# Altium schematic sheet Sheet1.SchDoc
size 420 x 297 mm; CheckedBy: Семенцов С. Г.; Author: Бакулевский М.; DocumentNumber: ИУ4.11.03.03.23.05.52.04.001 Э3; SheetNumber: 1; SheetTotal: 1; DocumentType: Схема электрическая принципиальная; FirstReferrence: ИУ4.11.03.03.23.05.52.04.001 СП
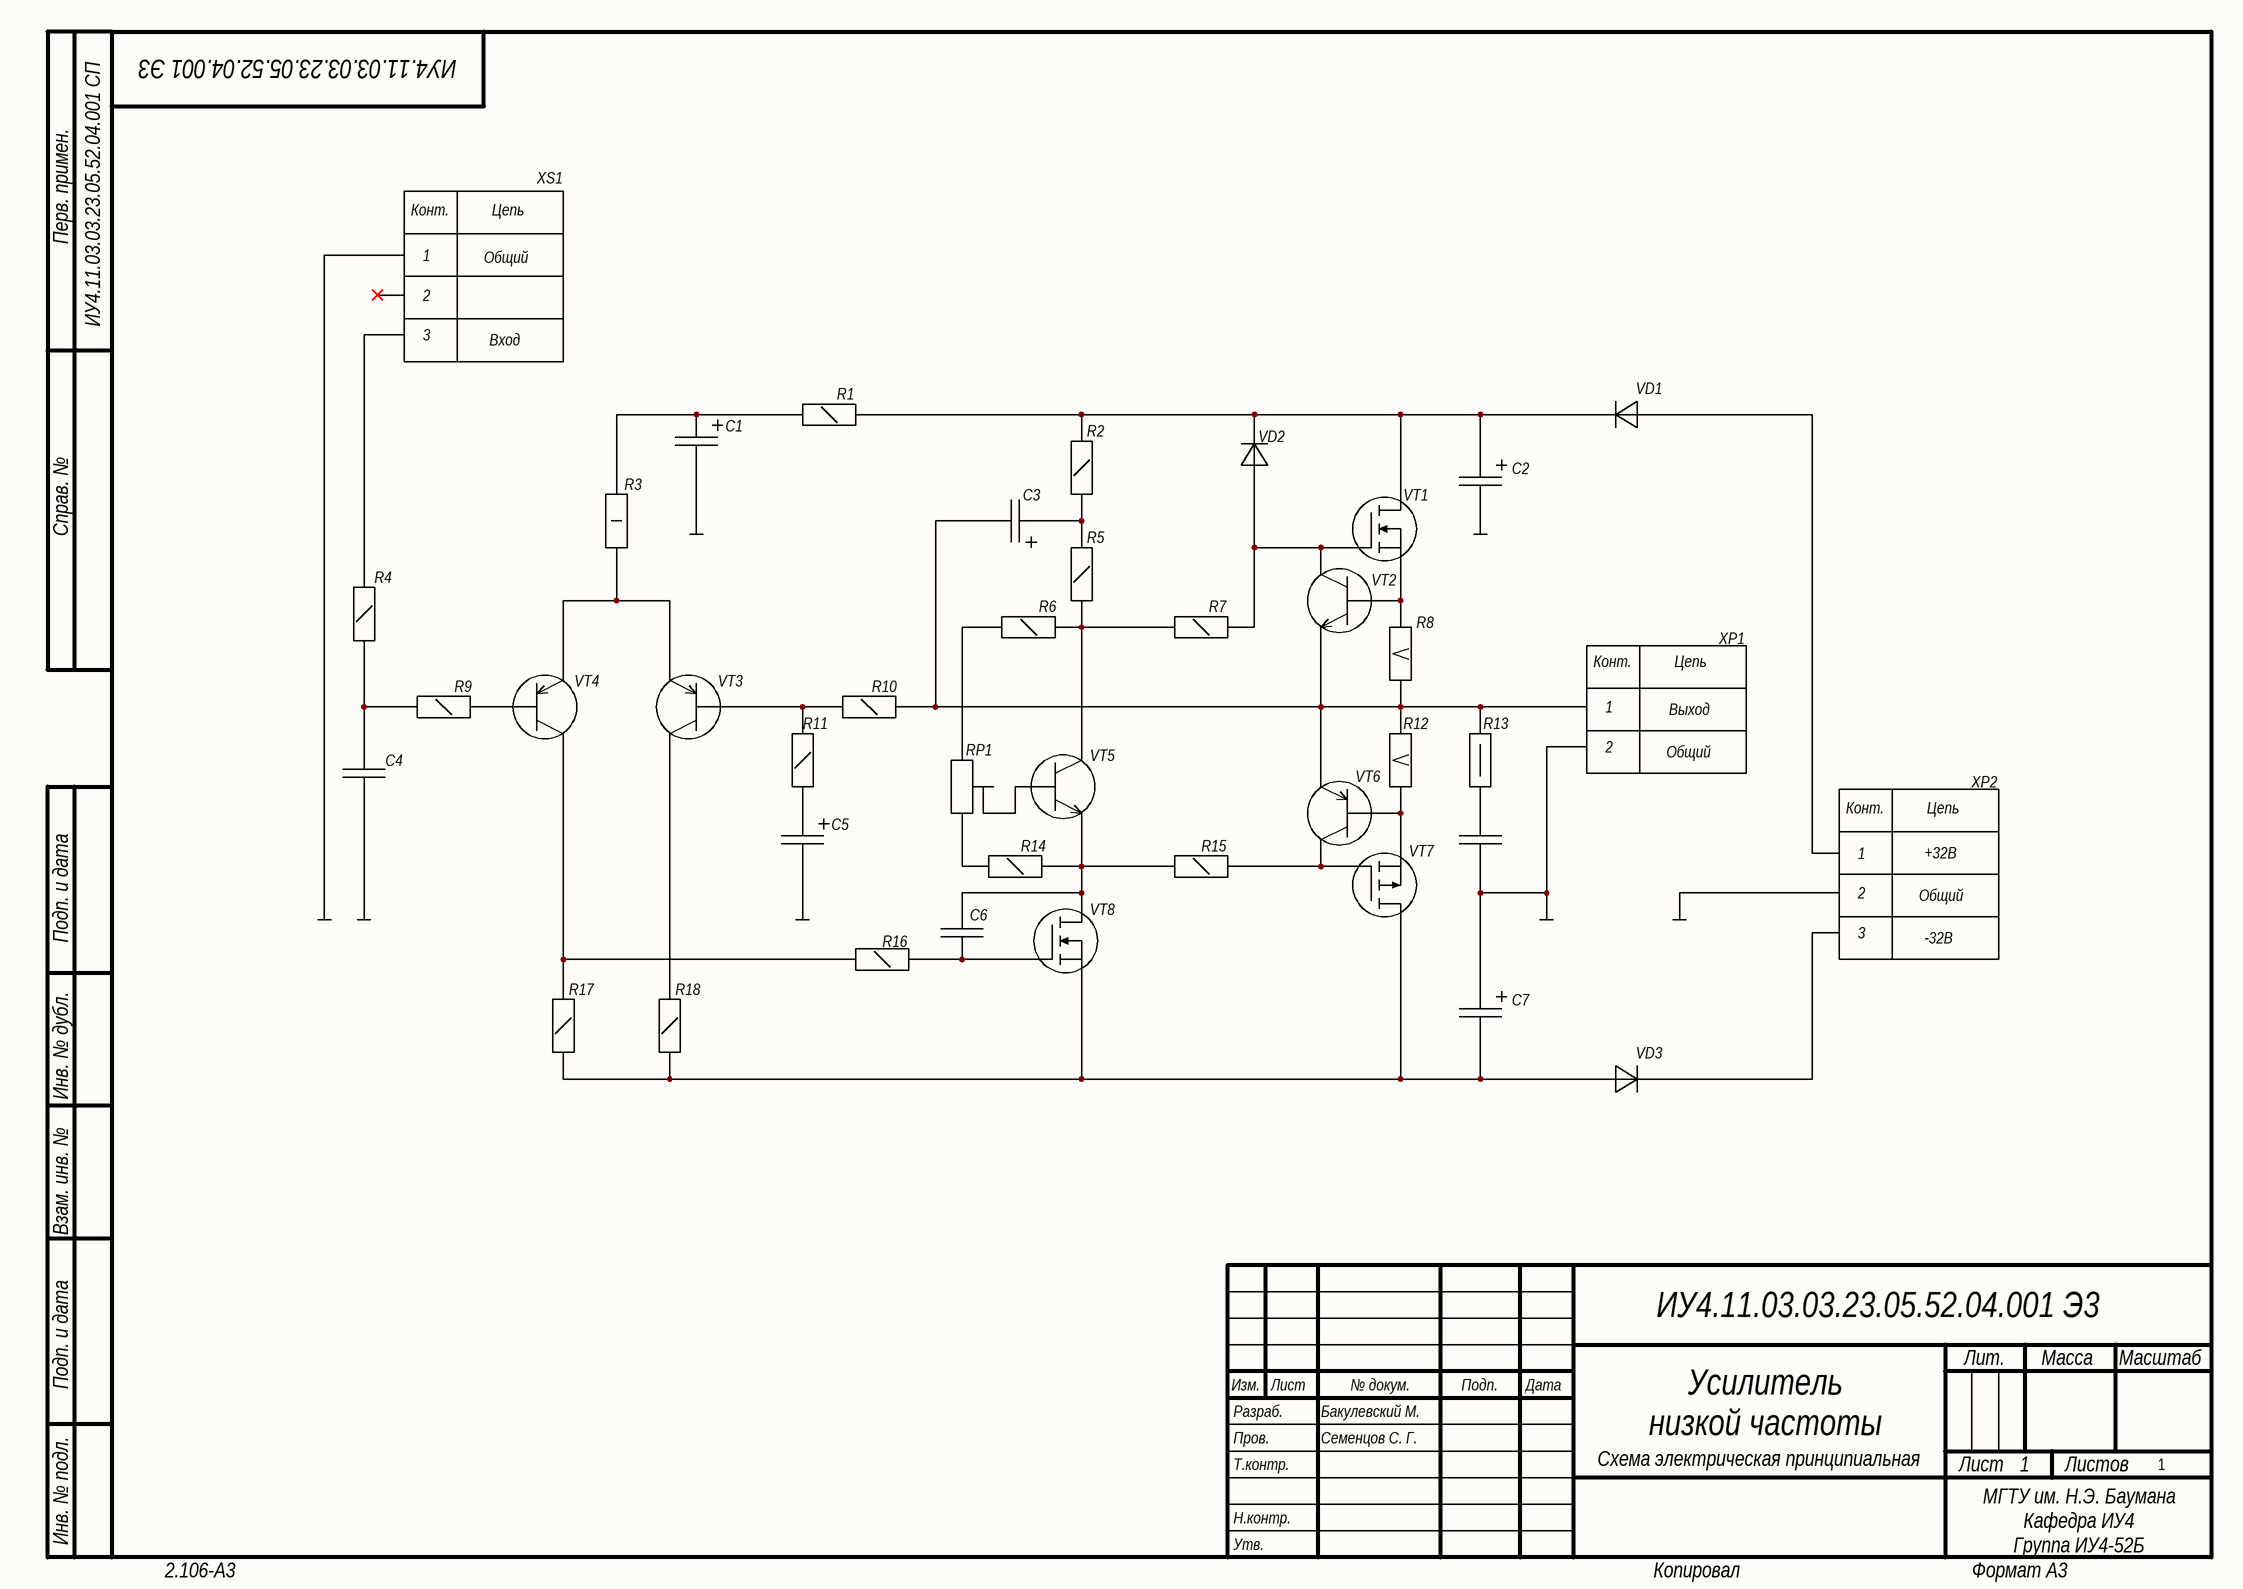
[diagram p0: Sheet1.SchDoc]

## Parts
C1  2200uF 35V  [CAPPR350-800X700]  (value not drawn)
C2  2200uF 35V  [CAPPR750-1600X3150]  (value not drawn)
C3  2200uF 35V  [CAPPR350-800X700]  (value not drawn)
C4  Cap Ceramic 100pF  [CAPRR508-350X500X500]  (value not drawn)
C5  100uF 100V  [CAPPR500-1000X2050]  (value not drawn)
C6  Cap Ceramic 100pF  [CAPRR508-350X500X500]  (value not drawn)
C7  2200uF 35V  [CAPPR750-1600X3150]  (value not drawn)
https://www.eetimes.com/ic-audio-power-amplifiers-and-zobel-networks-one-size-does-not-fit-all/1  2200uF 35V  [CAPR1000-400X1300X950]  (value not drawn)
R1  Resistor 0.25W  [RES1016-630X250]  (value not drawn)
R2  Resistor 0.25W  [RES1016-630X250]  (value not drawn)
R3  Resistor 1W  [RES1651-1000X390]  (value not drawn)
R4  Resistor 0.25W  [RES1016-630X250]  (value not drawn)
R5  Resistor 0.25W  [RES1016-630X250]  (value not drawn)
R6  Resistor 0.25W  [RES1016-630X250]  (value not drawn)
R7  Resistor 0.25W  [RES1016-630X250]  (value not drawn)
R8  Resistor 5W  [RES_5W]  (value not drawn)
R9  Resistor 0.25W  [RES1016-630X250]  (value not drawn)
R10  Resistor 0.25W  [RES1016-630X250]  (value not drawn)
R11  Resistor 0.25W  [RES1016-630X250]  (value not drawn)
R12  Resistor 5W  [RES_5W]  (value not drawn)
R13  Resistor 1W  [RES1651-1000X390]  (value not drawn)
R14  Resistor 0.25W  [RES1016-630X250]  (value not drawn)
R15  Resistor 0.25W  [RES1016-630X250]  (value not drawn)
R16  Resistor 0.25W  [RES1016-630X250]  (value not drawn)
R17  Resistor 0.25W  [RES1016-630X250]  (value not drawn)
R18  Resistor 0.25W  [RES1016-630X250]  (value not drawn)
RP1  (no value)  [TRIM_BOURNS_3296W]
VD1  Diode 15SQ045  [R6]  (value not drawn)
VD2  Diode 1N4002  [DO-41]  (value not drawn)
VD3  Diode 15SQ045  [R6]  (value not drawn)
VT1  (no value)  [TO-220AB]
VT2  BC546C  [TO-92-A]  (value not drawn)
VT3  BC556B  [TO-92-A]  (value not drawn)
VT4  BC556B  [TO-92-A]  (value not drawn)
VT5  Transistor NPN BC546C  [TO-92-A]  (value not drawn)
VT6  BC556B  [TO-92-A]  (value not drawn)
VT7  IRF9510PBF  [TO-220AB]  (value not drawn)
VT8  (no value)  [TO-92-A]
XP1  Connector Dynamic 2 pin  [15EDGRC-3.81-02P]  (value not drawn)
XP2  Общий  [15EDGRC-3.81-03P]  (value not drawn)
XS1  Общий  [ST-025]  (value not drawn)

## Nets
GND: C1.2 C2.2 C4.2 C5.2 C7.1 https://www.eetimes.com/ic-audio-power-amplifiers-and-zobel-networks-one-size-does-not-fit-all/1.2 XP1.2 XP2.2 XS1.1
NetC1_1: C1.1 R1.1 R3.1
NetC2_1: C2.1 R1.2 R2.2 VD1.2(К) VD2.2(К) VT1.2(D)
NetC3_1: C3.1 R2.1 R5.2
NetC3_2: C3.2 R8.1 R10.2 R12.2 R13.2 VT2.3(Э) VT6.3(Э) XP1.1
NetC4_1: C4.1 R4.1 R9.1
NetC5_1: C5.1 R11.2
NetC6_1: C6.1 R16.1 VT8.2(G)
NetC6_2: C6.2 R14.1 R15.1 VT5.3(Э) VT8.1(D)
NetC7_2: C7.2 R17.1 R18.1 VD3.1(А) VT7.2(D) VT8.3(S)
Nethttps://www.eetimes.com/ic-audio-power-amplifiers-and-zobel-networks-one-size-does-not-fit-all/1_1: https://www.eetimes.com/ic-audio-power-amplifiers-and-zobel-networks-one-size-does-not-fit-all/1.1 R13.1
NetR3_2: R3.2 VT3.3(Э) VT4.3(Э)
NetR4_2: R4.2 XS1.3
NetR5_1: R5.1 R6.2 R7.1 VT5.1(К)
NetR6_1: R6.1 RP1.1
NetR7_2: R7.2 VD2.1(А) VT1.1(G) VT2.1(К)
NetR8_2: R8.2 VT1.3(S) VT2.2(Б)
NetR9_2: R9.2 VT4.2(Б)
NetR10_1: R10.1 R11.1 VT3.2(Б)
NetR12_1: R12.1 VT6.2(Б) VT7.3(S)
NetR14_2: R14.2 RP1.3
NetR15_2: R15.2 VT6.1(К) VT7.1(G)
NetR16_2: R16.2 R17.2 VT4.1(К)
NetR18_2: R18.2 VT3.1(К)
NetRP1_2: RP1.2 VT5.2(Б)
NetVD1_1: VD1.1(А) XP2.1
NetVD3_2: VD3.2(К) XP2.3

Not connected (* = marked no-connect by the designer): XS1 2*

## Notes on the sheet
- Общий
- Вход
- Выход
- +32В
- -32В
- Усилитель
  низкой частоты
- МГТУ им. Н.Э. Баумана
  Кафедра ИУ4
  Группа ИУ4-52Б
- Перв. примен.
- Справ. №
- Подп. и дата
- Инв. № дубл.
- Взам. инв. №
- Разраб.
- Изм.
- Лист
- № докум.
- Подп.
- Дата
- Лит.
- Масса
- Масштаб
- Пров.
- Т.контр.
- Листов
- Инв. № подл.
- Утв.
- Н.контр.
- 2.106-A3
- Копировал
- Формат А3
- (in symbol Connector Audio 3 pin) Конт.; Цепь
- (in symbol Connector Dynamic 2 pin) Конт.; Цепь
- (in symbol Connector Power 3 pin) Конт.; Цепь

## Library data of the parts
C1 C3 = Cap Polarity 47uF 50V: Type: Конденсатор
C2 C7 = Cap Polarity 2200uF 35V: Type: Конденсатор
C4 C6 = Cap Ceramic 100pF: Type: Конденсатор
C5 = Cap Polarity 100uF 100V: Type: Конденсатор
https://www.eetimes.com/ic-audio-power-amplifiers-and-zobel-networks-one-size-does-not-fit-all/1 = Cap Film 0.68uF 250V: Type: Конденсатор
RP1 = Resistor Trimmer 1K: Manufacturer: Bourns; PartNumber: 3296W-1-103LF; TypeResistor: Resistor film; Power: 0.5W; Package: 3296W; HelpURL: https://www.digikey.com/product-detail/en/bourns-inc/3296W-1-103LF/3296W-103LF-ND/1088045; ValueManufacturerPartNumber: =TypeResistor+', '+Value+', '+Tolerance+', '+Package+', '+Power+', '+Temperature; Temperature: -55...+125°C
VD1 VD3 = Diode 15SQ045: Type: Диод; Published: 18.05.2010; Publisher: Andrew Danich
VD2 = Diode 1N4002: Type: Диод; Published: 18.05.2010; Publisher: Andrew Danich
VT1 = IRF510PBF
VT8 = Transistor N-Mosfet BS170
XP2 = Connector Power 3 pin
XS1 = Connector Audio 3 pin
R1 R2 R4-R7 R9-R11 R14-R18 = Resistor 0.25W: Type: Резистор
R3 R13 = Resistor 1W: Type: Резистор
R8 R12 = Resistor 5W: Type: Резистор